# EAGLE design Main+Board (EAGLE 9.7.0)
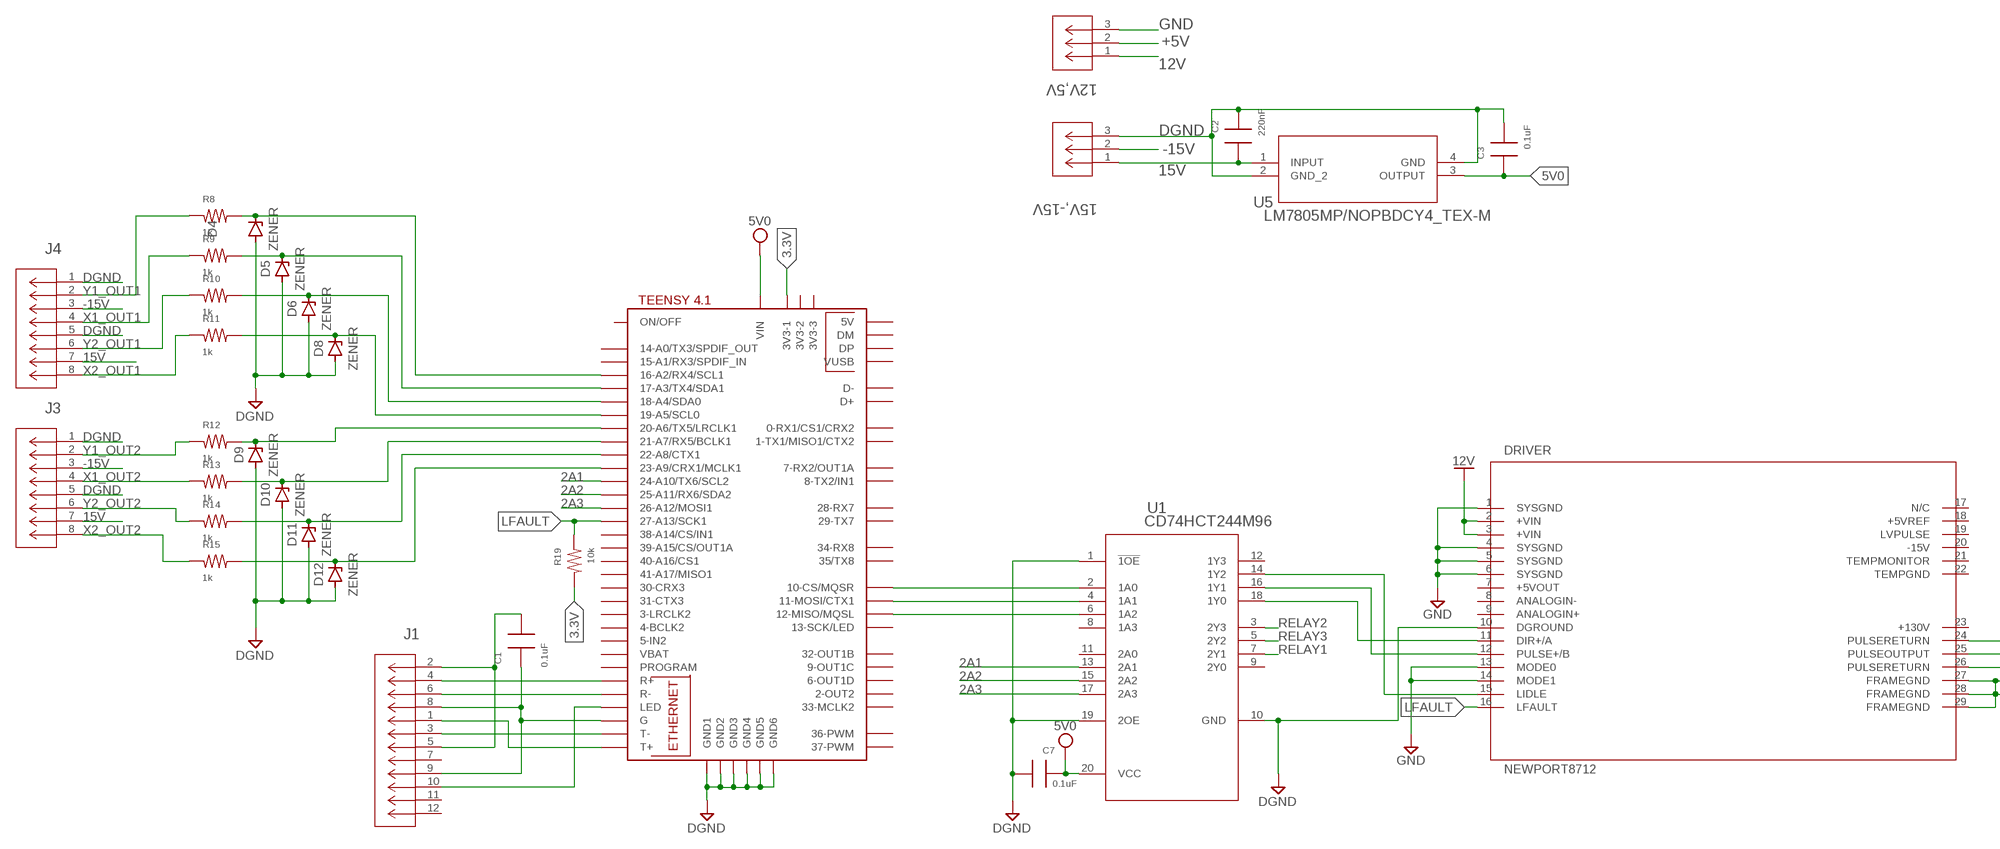
[diagram p0: schematic, sheet 1, part 1 of 2]
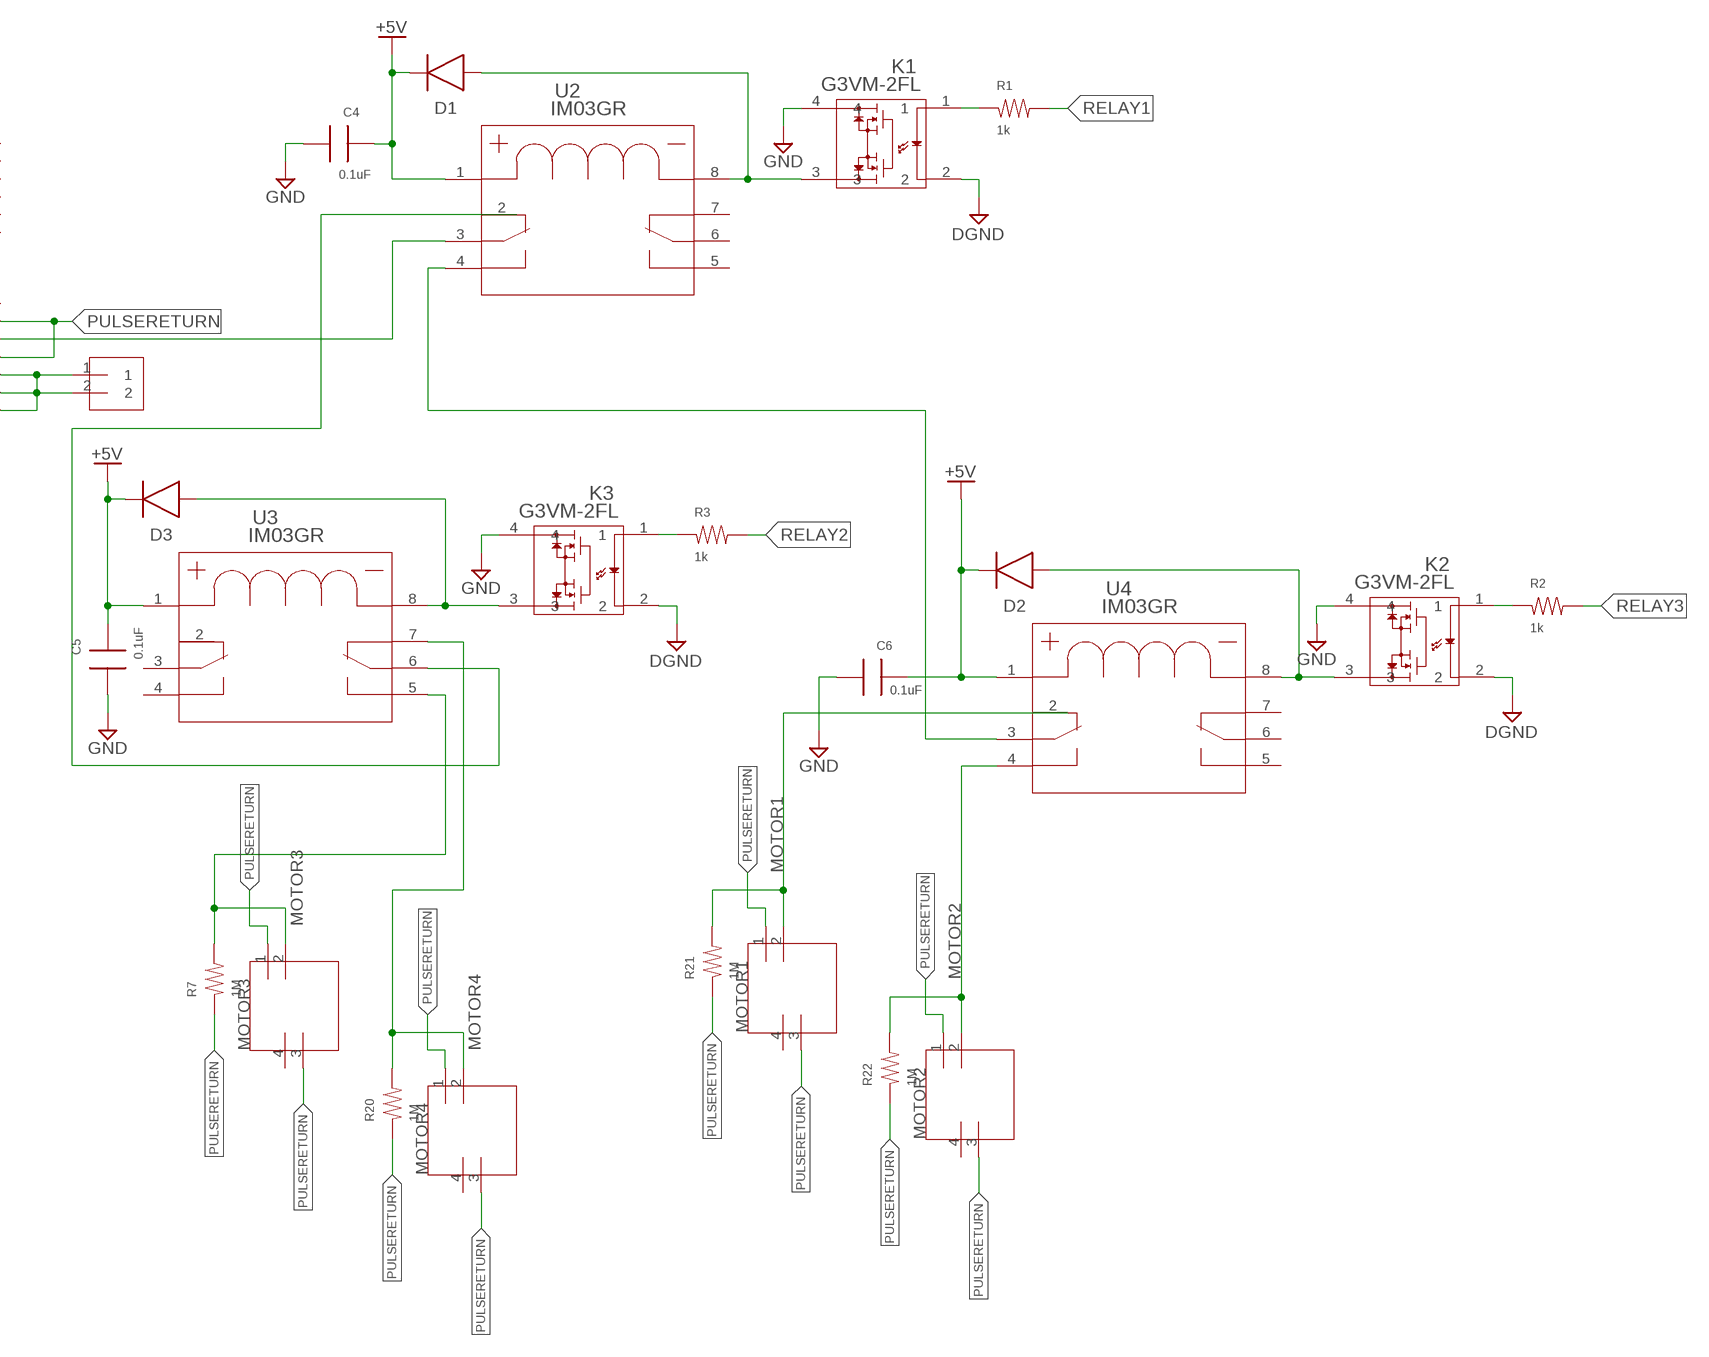
[diagram p1: schematic, sheet 1, part 2 of 2]

## Parts
12V,5V  1729021  [CONN_1729021_PXC]
15V,-15V  1729021  [CONN_1729021_PXC]
C1  0.1uF  CAP0603  [0603]
C2  220nF  CAP0603  [0603]
C3  0.1uF  CAP0603  [0603]
C4  0.1uF  CAP0603  [0603]
C5  0.1uF  CAP0603  [0603]
C6  0.1uF  CAP0603  [0603]
C7  0.1uF  CAP0603  [0603]
D1  1N4448W  DIODE_1N4448W-TP_SOD123G  [SOD3715X135]
D2  1N4448W  DIODE_1N4448W-TP_SOD123G  [SOD3715X135]
D3  1N4448W  DIODE_1N4448W-TP_SOD123G  [SOD3715X135]
D4  ZENER  ZENER_DO-219-AB(SOD123F)  [SODFL3718X115]
D5  ZENER  ZENER_DO-219-AB(SOD123F)  [SODFL3718X115]
D6  ZENER  ZENER_DO-219-AB(SOD123F)  [SODFL3718X115]
D8  ZENER  ZENER_DO-219-AB(SOD123F)  [SODFL3718X115]
D9  ZENER  ZENER_DO-219-AB(SOD123F)  [SODFL3718X115]
D10  ZENER  ZENER_DO-219-AB(SOD123F)  [SODFL3718X115]
D11  ZENER  ZENER_DO-219-AB(SOD123F)  [SODFL3718X115]
D12  ZENER  ZENER_DO-219-AB(SOD123F)  [SODFL3718X115]
DRIVER  NEWPORT8712  [NEWPORT8712]
J1  J1B1211CCD  [CONN12_J1B1211CCD_WIZ]
J3  75869-332LF  [CONN_332LF_AMP]
J4  75869-332LF  [CONN_332LF_AMP]
K1  G3VM-2FL  [A-DIP4_THD_OMR]
K2  G3VM-2FL  [A-DIP4_THD_OMR]
K3  G3VM-2FL  [A-DIP4_THD_OMR]
MOTOR1  TM5RJ3-44  [TM5RJ3-44]
MOTOR2  TM5RJ3-44  [TM5RJ3-44]
MOTOR3  TM5RJ3-44  [TM5RJ3-44]
MOTOR4  TM5RJ3-44  [TM5RJ3-44]
R1  1k  RES0603  [0603]
R2  1k  RES0603  [0603]
R3  1k  RES0603  [0603]
R7  1M  RES1210  [1210]
R8  1k  RES0603  [0603]
R9  1k  RES0603  [0603]
R10  1k  RES0603  [0603]
R11  1k  RES0603  [0603]
R12  1k  RES0603  [0603]
R13  1k  RES0603  [0603]
R14  1k  RES0603  [0603]
R15  1k  RES0603  [0603]
R19  10k  RES0603  [0603]
R20  1M  RES1210  [1210]
R21  1M  RES1210  [1210]
R22  1M  RES1210  [1210]
U1  CD74HCT244M96  [DW20]
U2  IM03GR  [RELAY8-239X396_230]
U3  IM03GR  [RELAY8-239X396_230]
U4  IM03GR  [RELAY8-239X396_230]
U5  LM7805MP/NOPBDCY4_TEX-M  [DCY4_TEX-M]
U$1  TEENSY41  [TEENSY41]
U$2  360272  [360272]

## Nets
2A1: U1.13(2A1) U$1.24-A10/TX6/SCL2
2A2: U1.15(2A2) U$1.25-A11/RX6/SDA2
2A3: U1.17(2A3) U$1.26-A12/MOSI1
3.3V: R19.2 U$1.3V3-1
5V0: C3.1 C7.2 U1.20(VCC) U5.3(OUTPUT) U$1.VIN
12V: 12V,5V.1 DRIVER.2(+VIN) DRIVER.3(+VIN)
15V: 15V,-15V.1 C2.1 J3.7 J4.7 U5.1(INPUT)
+5V: 12V,5V.2 C4.2 C5.2 C6.2 D1.1(C) D2.1(C) D3.1(C) U2.1 U3.1 U4.1
-15V: 15V,-15V.2 J3.3 J4.3
DGND: 15V,-15V.3 C2.2 C3.2 C7.1 D4.2(A) D5.2(A) D6.2(A) D8.2(A) D9.2(A) D10.2(A) D11.2(A) D12.2(A) DRIVER.10(DGROUND) J3.1 J3.5 J4.1 J4.5 K1.2 K2.2 K3.2 U1.1(!1OE) U1.10(GND) U1.19(2OE) U5.2(GND_2) U5.4(GND) U$1.GND1 U$1.GND2 U$1.GND3 U$1.GND4 U$1.GND5 U$1.GND6
FRAMEGND: DRIVER.27(FRAMEGND) DRIVER.28(FRAMEGND) DRIVER.29(FRAMEGND) U$2.1 U$2.2
GND: 12V,5V.3 C4.1 C5.1 C6.1 DRIVER.1(SYSGND) DRIVER.4(SYSGND) DRIVER.5(SYSGND) DRIVER.6(SYSGND) DRIVER.13(MODE0) DRIVER.14(MODE1) K1.4 K2.4 K3.4
LFAULT: DRIVER.16(LFAULT) R19.1 U$1.27-A13/SCK1
MOTOR1: MOTOR1.2 R21.2 U4.2
MOTOR2: MOTOR2.2 R22.2 U4.4
MOTOR3: MOTOR3.2 R7.2 U3.5
MOTOR4: MOTOR4.2 R20.2 U3.7
N$1: D10.1(C) R13.2 U$1.21-A7/RX5/BCLK1
N$3: K1.1 R1.1
N$5: D4.1(C) R8.2 U$1.16-A2/RX4/SCL1
N$6: D5.1(C) R9.2 U$1.17-A3/TX4/SDA1
N$7: D6.1(C) R10.2 U$1.18-A4/SDA0
N$8: D8.1(C) R11.2 U$1.19-A5/SCL0
N$9: U1.2(1A0) U$1.10-CS\MQSR(10-CS/MQSR)
N$10: U1.4(1A1) U$1.11-MOSI/CTX1
N$11: U1.6(1A2) U$1.12-MISO/MQSL
N$12: K2.1 R2.1
N$13: K3.1 R3.1
N$17: C1.2 J1.2 J1.5
N$22: DRIVER.15(LIDLE) U1.14(1Y2)
N$23: DRIVER.12(PULSE+/B) U1.16(1Y1)
N$24: DRIVER.11(DIR+/A) U1.18(1Y0)
N$29: D3.2(A) K3.3 U3.8
N$31: D9.1(C) R12.2 U$1.20-A6/TX5/LRCLK1
N$32: U2.2 U3.6
N$34: U2.4 U4.3
N$35: D1.2(A) K1.3 U2.8
N$36: D2.2(A) K2.3 U4.8
N$38: D12.1(C) R15.2 U$1.23-A9/CRX1/MCLK1
N$43: D11.1(C) R14.2 U$1.22-A8/CTX1
N$50: C1.1 J1.8 J1.9 U$1.G
N$51: J1.10 U$1.LED
PULSEOUTPUT: DRIVER.25(PULSEOUTPUT) U2.3
PULSERETURN: DRIVER.24(PULSERETURN) DRIVER.26(PULSERETURN) MOTOR1.1 MOTOR1.3 MOTOR2.1 MOTOR2.3 MOTOR3.1 MOTOR3.3 MOTOR4.1 MOTOR4.3 R7.1 R20.1 R21.1 R22.1
R_N: J1.6 U$1.R-
R_P: J1.4 U$1.R+
RELAY1: R1.2 U1.7(2Y1)
RELAY2: R3.2 U1.3(2Y3)
RELAY3: R2.2 U1.5(2Y2)
T_N: J1.3 U$1.T-
T_P: J1.1 U$1.T+
X1_OUT1: J4.4 R9.1
X1_OUT2: J3.4 R13.1
X2_OUT1: J4.8 R11.1
X2_OUT2: J3.8 R15.1
Y1_OUT1: J4.2 R8.1
Y1_OUT2: J3.2 R12.1
Y2_OUT1: J4.6 R10.1
Y2_OUT2: J3.6 R14.1
Unconnected: DRIVER.7(+5VOUT) DRIVER.8(ANALOGIN-) DRIVER.9(ANALOGIN+) DRIVER.17(N/C) DRIVER.18(+5VREF) DRIVER.19(LVPULSE) DRIVER.20(-15V) DRIVER.21(TEMPMONITOR) DRIVER.22(TEMPGND) DRIVER.23(+130V) J1.7 J1.11 J1.12 MOTOR1.4 MOTOR2.4 MOTOR3.4 MOTOR4.4 U1.8(1A3) U1.9(2Y0) U1.11(2A0) U1.12(1Y3) U2.5 U2.6 U2.7 U3.2 U3.3 U3.4 U4.5 U4.6 U4.7 U$1.0-RX1/CS1/CRX2 U$1.1-TX1/MISO1/CTX2 U$1.2-OUT2 U$1.3-LRCLK2 U$1.3V3-2 U$1.3V3-3 U$1.4-BCLK2 U$1.5-IN2 U$1.6-OUT1D U$1.7-RX2/OUT1A U$1.8-TX2/IN1 U$1.9-OUT1C U$1.13-SCK/LED U$1.14-A0/TX3/SPDIF_OUT U$1.15-A1/RX3/SPDIF_IN U$1.28-RX7 U$1.29-TX7 U$1.30-CRX3 U$1.31-CTX3 U$1.32-OUT1B U$1.33-MCLK2 U$1.34-RX8 U$1.35-TX8(35/TX8) U$1.36-PWM U$1.37-PWM U$1.38-A14/CS/IN1 U$1.39-A15/CS/OUT1A U$1.40-A16/CS1 U$1.41-A17/MISO1 U$1.+5V(5V) U$1.D+ U$1.D- U$1.DM U$1.DP U$1.ON/OFF U$1.PROGRAM U$1.VBAT U$1.VUSB

## Library data of the parts
12V,5V 15V,-15V = 1729021:1729021; BUILT_BY: EMA_Cory; COPYRIGHT: Copyright (C) 2018 Accelerated Designs. All rights reserved; DATASHEET: https://www.phoenixcontact.com/online/portal/us/?uri=pxc-oc-itemdetail:pid=1729021&library=usen&pcck=P-11-01-05&tab=1&selectedCategory=ALL; DIGIKEY: 277-1237-ND; MANUFACTURER_PART_NUMBER: 1729021; SOURCELIBRARY: Phoenix_Contact_2020-02-20; VENDOR: Phoenix Contact
C1 C3-C7 = rlc-jqi:CAP: SMT Capacitor; DIGIKEY: 478-7018-1-ND
C2 = rlc-jqi:CAP: SMT Capacitor; DIGIKEY: 732-7991-1-ND
D1-D3 = Diode:DIODE_: Diode Rectifier - Popular parts; CATEGORY: Diode; DESCRIPTION: DIODE GEN PURP 75V 250MA SOD123; DIGIKEY: 2721-1N4148WTR-ND; MANUFACTURER: Micro Commercial Co; SUB-CATEGORY: Rectifier
D4-D6 D8-D12 = Diode:ZENER: Zener Diode - Generic; CATEGORY: Diode; DIGIKEY: 846-KDZVTR3.3BCT-ND; SUB-CATEGORY: Zener
DRIVER = Newport 8712:NEWPORT8712
J1 = J1B1211CCD:J1B1211CCD; BUILT_BY: EMA_Matt; COPYRIGHT: Copyright (C) 2018 Accelerated Designs. All rights reserved; DATASHEET: http://wizwiki.net/wiki/lib/exe/fetch.php?media=products:wiz550web:wiz550webds_kr:j1b1211ccd.pdf; DIGIKEY: 1278-1052-ND; MANUFACTURER_PART_NUMBER: J1B1211CCD; SOURCELIBRARY: WIZnet_2020-06-05; VENDOR: WIZnet
J3 J4 = 75869-332LF:75869-332LF; BUILT_BY: EMA_Matt; COPYRIGHT: Copyright (C) 2018 Accelerated Designs. All rights reserved; DIGIKEY: 609-5123-ND; MANUFACTURER_PART_NUMBER: 75869-332LF; SOURCELIBRARY: Amphenol_2019-10-30; VENDOR: Amphenol
K1-K3 = G3VM-2FL:G3VM-2FL; BUILT_BY: EMA_Justin; COPYRIGHT: Copyright (C) 2018 Accelerated Designs. All rights reserved; DIGIKEY: Z2711-ND; MANUFACTURER_PART_NUMBER: G3VM-2FL; SOURCELIBRARY: Omron_2020-03-23; VENDOR: Omron
MOTOR1-MOTOR4 = TM5RJ3-44:TM5RJ3-44; DIGIKEY: H11287-ND
R1-R3 R8-R15 = rlc-jqi:RES: SMT Resistor; DIGIKEY: P123733CT-ND
R7 R20-R22 = rlc-jqi:RES: SMT Resistor; DIGIKEY: 13-RC1210FR-071MLCT-ND
R19 = rlc-jqi:RES: SMT Resistor; DIGIKEY: YAG1236CT-ND
U1 = CD74HCT244:CD74HCT244M96; DATASHEET_URL: http://www.ti.com/lit/gpn/CD74HCT244; DESCRIPTION: High Speed CMOS Logic Non-Inverting Octal Buffer/Line Drivers with 3-State Outputs; DIGIKEY: 296-14552-1-ND; FAMILY_NAME: NON-INVERTING BUFFER/DRIVER; GENERIC_PART_NUMBER: CD74HCT244; INDUSTRY_STD_PKG_TYPE: SOIC; MANUFACTURER: Texas Instruments; PACKAGE_DESIGNATOR: DW; PIN_COUNT: 20
U2-U4 = IM03GR:IM03GR; BUILT_BY: EMA_UL_Team; COPYRIGHT: Copyright (C) 2016 Accelerated Designs. All rights reserved; DIGIKEY: PB1061CT-ND; MANUFACTURER_PART_NUMBER: IM03GR; SOURCELIBRARY: Tyco_2012-1-03; VENDOR: TE Connectivity
U5 = LM7805MP:LM7805MP/NOPB; BUILT_BY: EMA_Jessica; COPYRIGHT: Copyright (C) 2018 Accelerated Designs. All rights reserved; DIGIKEY: 296-44517-1-ND; MANUFACTURER_PART_NUMBER: LM7805MP/NOPB; SOURCELIBRARY: TI_2019-05-10; VENDOR: Texas Instruments
U$1 = teensy:TEENSY41; DIGIKEY: 1568-DEV-16771-ND
U$2 = 360272:360272; DIGIKEY: 1849-1246-ND

## Board
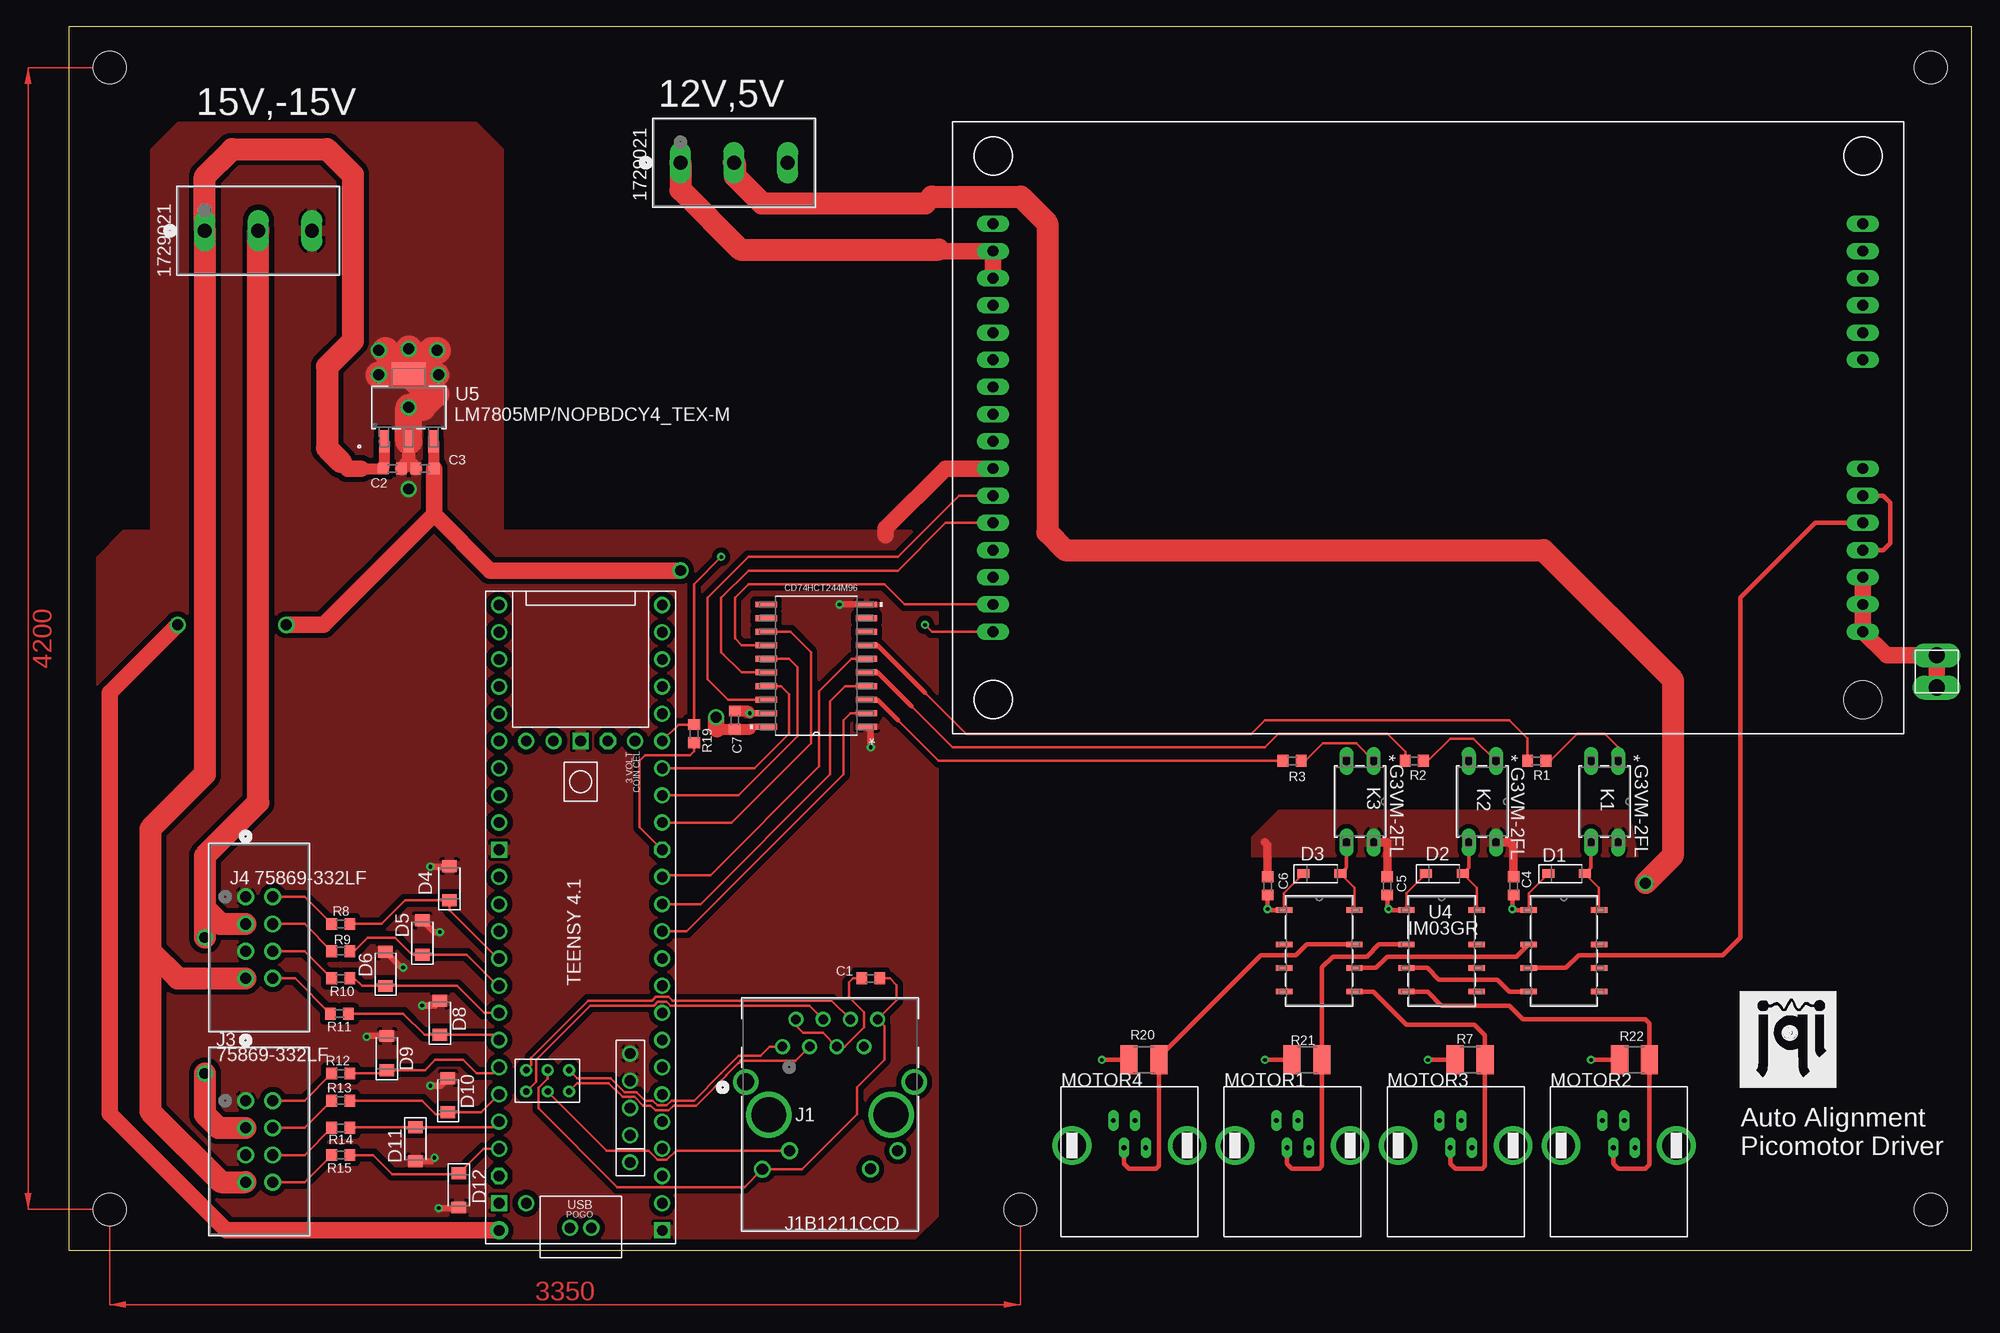
[diagram p2: board, top side]
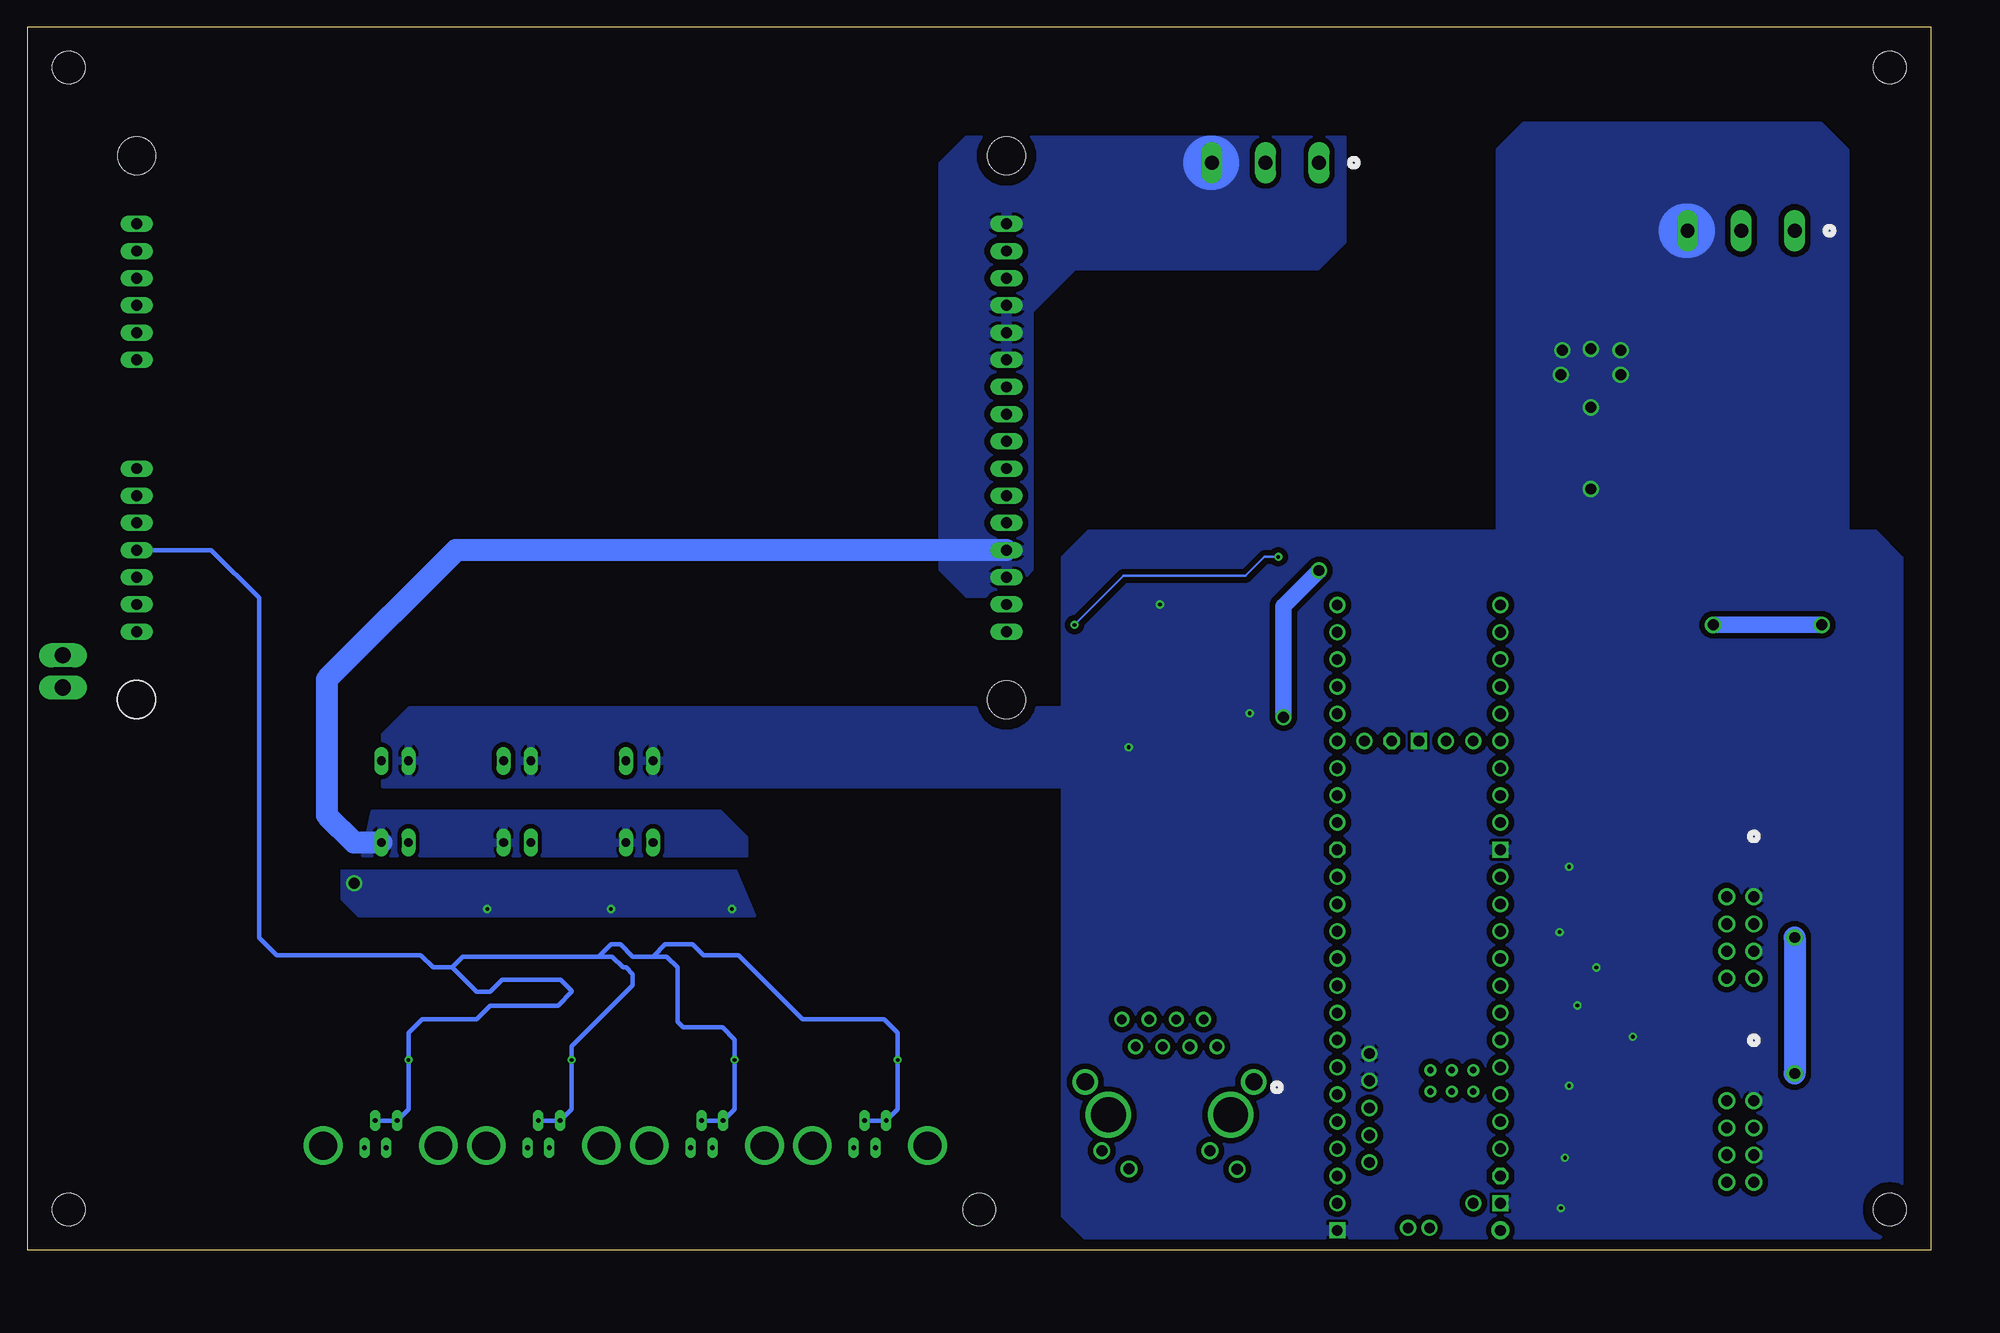
[diagram p3: board, bottom side, seen from below]

Size 177.8 x 114.3 mm. Coordinates in mm from the lower left corner, seen from the top.
Outline: 0,0 177.8,0 177.8,114.3 0,114.3 0,0
Copper layers (1*16): Top / Bottom
Stack-up Default Layer Stack: Top User Defined 0.035mm / Dielectric-1 User Defined 1.5mm / Bottom User Defined 0.035mm
Design rules: minimum copper width 6mil, minimum drill size 0.35mm, copper clearance wire_polygon to wire_polygon 8mil, copper clearance wire_polygon to via 8mil, copper clearance pad_smd to pad_smd 8mil, copper clearance pad_smd to via 8mil, copper clearance via to via 8mil, copper clearance wire_polygon to pad_smd 6mil, copper clearance smd to pad (same net) 6mil, copper clearance smd to via (same net) 6mil, copper clearance smd to smd (same net) 6mil, dimension clearance 40mil, via restrict clearance 0mil, restrict clearance 0mil, drill distance 6mil, keepout clearance 0mil
Holes 3.05 mm at 88.9,3.81 173.99,3.81 3.81,3.81 3.81,110.49 173.99,110.49
Holes 3.56 mm at 86.36,51.44 86.36,102.23 167.64,102.23 167.64,51.44

### Footprints (pad centres in the part's own frame; a part is rotated, then mirrored left to right if it is on the bottom)
CONN_1729021_PXC = drill 1.295 pad 1.803 long: 1 0,0; 2 5.004,0; 3 10.008,0
0603 = smd 1 x 1.1: 1 -0.85,0; 2 0.85,0
SOD3715X135 = smd 1.127 x 0.784: 1 -1.722,0; 2 1.722,0
SODFL3718X115 = smd 1.115 x 1.361: 1 -1.6,0; 2 1.6,0
NEWPORT8712 = drill 1.016 long: 1 3.81,47.625; 2 3.81,45.085; 3 3.81,42.545; 4 3.81,40.005; 5 3.81,37.465; 6 3.81,34.925; 7 3.81,32.385; 8 3.81,29.845; 9 3.81,27.305; 10 3.81,24.765; 11 3.81,22.225; 12 3.81,19.685; 13 3.81,17.145; 14 3.81,14.605; 15 3.81,12.065; 16 3.81,9.525; 17 85.09,47.625; 18 85.09,45.085; 19 85.09,42.545; 20 85.09,40.005; 21 85.09,37.465; 22 85.09,34.925; 23 85.09,24.765; 24 85.09,22.225; 25 85.09,19.685; 26 85.09,17.145; 27 85.09,14.605; 28 85.09,12.065; 29 85.09,9.525
CONN12_J1B1211CCD_WIZ = drill 0.889 pad 1.397: 1 -0.635,3.785; 2 0.635,6.325; 3 1.905,3.785; 4 3.175,6.325; 5 4.445,3.785; 6 5.715,6.325; 7 6.985,3.785; 8 8.255,6.325 | drill 1.041 pad 1.549: 9 -2.515,-7.671; 10 0.025,-5.944; 11 7.595,-7.645; 12 10.135,-5.944 | drill 1.6 pad 2.108: 13 -4.064,0.483; 16 11.684,0.483 | drill 3.251 pad 3.759: 14 -1.905,-2.591; 15 9.525,-2.591
CONN_332LF_AMP = drill 1.041: 1 0,0; 2 0,2.54; 3 2.54,0; 4 2.54,2.54; 5 5.08,0; 6 5.08,2.54; 7 7.62,0; 8 7.62,2.54
A-DIP4_THD_OMR = drill 0.813 pad 1.321 long: 1 0,0; 2 0,-2.54; 3 7.62,-2.54; 4 7.62,0
TM5RJ3-44 = drill 0.45 long: 1 4.88,10.84; 2 5.89,8.3; 3 6.91,10.84; 4 7.92,8.3 | drill 2.6 pad 2.8: P$1 1.02,8.5; P$2 11.78,8.5
1210 = smd 1.6 x 2.7: 1 -1.4,0; 2 1.4,0
DW20 = smd 1.981 x 0.559: 1 -4.686,5.715; 2 -4.686,4.445; 3 -4.686,3.175; 4 -4.686,1.905; 5 -4.686,0.635; 6 -4.686,-0.635; 7 -4.686,-1.905; 8 -4.686,-3.175; 9 -4.686,-4.445; 10 -4.686,-5.715; 11 4.686,-5.715; 12 4.686,-4.445; 13 4.686,-3.175; 14 4.686,-1.905; 15 4.686,-0.635; 16 4.686,0.635; 17 4.686,1.905; 18 4.686,3.175; 19 4.686,4.445; 20 4.686,5.715
RELAY8-239X396_230 = smd 1.524 x 0.508: 1 -3.289,3.835; 2 -3.289,0.635; 3 -3.289,-1.575; 4 -3.289,-3.785; 5 3.289,-3.785; 6 3.289,-1.575; 7 3.289,0.635; 8 3.289,3.835
DCY4_TEX-M = smd 0.94 x 2.07: 1 -2.311,-3.169; 2 0,-3.169; 3 2.311,-3.169 | smd 3.2 x 2.07: 4 0,3.169
TEENSY41 = drill 1: 0-RX1/CS1/CRX2 -27.94,-7.62; 1-TX1/MISO1/CTX2 -25.4,-7.62; 2-OUT2 -22.86,-7.62; 3-LRCLK2 -20.32,-7.62; 4-BCLK2 -17.78,-7.62; 5-IN2 -15.24,-7.62; 6-OUT1D -12.7,-7.62; 7-RX2/OUT1A -10.16,-7.62; 8-TX2/IN1 -7.62,-7.62; 9-OUT1C -5.08,-7.62; 10-CS\MQSR -2.54,-7.62; 11-MOSI/CTX1 0,-7.62; 12-MISO/MQSL 2.54,-7.62; 13-SCK/LED 2.54,7.62; 14-A0/TX3/SPDIF_OUT 0,7.62; 15-A1/RX3/SPDIF_IN -2.54,7.62; 16-A2/RX4/SCL1 -5.08,7.62; 17-A3/TX4/SDA1 -7.62,7.62; 18-A4/SDA0 -10.16,7.62; 19-A5/SCL0 -12.7,7.62; 20-A6/TX5/LRCLK1 -15.24,7.62; 21-A7/RX5/BCLK1 -17.78,7.62; 22-A8/CTX1 -20.32,7.62; 23-A9/CRX1/MCLK1 -22.86,7.62; 24-A10/TX6/SCL2 7.62,-7.62; 25-A11/RX6/SDA2 10.16,-7.62; 26-A12/MOSI1 12.7,-7.62; 27-A13/SCK1 15.24,-7.62; 28-RX7 17.78,-7.62; 29-TX7 20.32,-7.62; 30-CRX3 22.86,-7.62; 31-CTX3 25.4,-7.62; 32-OUT1B 27.94,-7.62; 33-MCLK2 27.94,7.62; 34-RX8 25.4,7.62; 35-TX8 22.86,7.62; 36-PWM 20.32,7.62; 37-PWM 17.78,7.62; 38-A14/CS/IN1 15.24,7.62; 39-A15/CS/OUT1A 12.7,7.62; 40-A16/CS1 10.16,7.62; 41-A17/MISO1 7.62,7.62; +5V -24.13,-4.62; D+ -30.25,-1; D- -30.25,1; DM -21.59,-4.62; DP -19.05,-4.62; GND4 -16.51,-4.62; GND5 -13.97,-4.62; ON/OFF 15.24,5.08; PROGRAM 15.24,2.54; VBAT 15.24,-5.08; VUSB -27.94,5.08 | drill 1 octagon: 3V3-1 5.08,-7.62; 3V3-2 15.24,-2.54; 3V3-3 -25.4,7.62 | drill 0.6: G -15.51,3.08; LED -17.51,3.08; R+ -17.51,5.08; R- -15.51,5.08; T+ -15.51,1.08; T- -17.51,1.08 | drill 1 square: GND1 -30.48,-7.62; GND2 15.24,0; GND3 5.08,7.62; GND6 -27.94,7.62 | drill 1 pad 1.676: VIN -30.48,7.62
360272 = drill 1.5 long: 1 2,0.5; 2 2,3.5

### Placement (x,y rotation side)
12V,5V  57.15,101.6 0 top
15V,-15V  12.7,95.25 0 top
C1  74.93,25.4 180 top
C2  30.23,73.03 0 top
C3  33.27,73.03 180 top
C4  135,34.04 270 top
C5  123.19,34.04 270 top
C6  112.01,34.04 270 top
C7  62.23,49.53 270 top
D1  139.95,35.18 0 top
D2  128.52,35.18 0 top
D3  117.09,35.18 0 top
D4  35.56,34.29 90 top
D5  33.02,29.21 90 top
D6  29.59,26.29 90 top
D8  34.67,21.72 90 top
D9  29.73,18.41 90 top
D10  35.43,14.48 90 top
D11  32.38,9.91 270 top
D12  36.45,5.59 270 top
DRIVER  82.55,48.26 0 top
J1  67.31,15.24 0 top
J3  16.51,13.97 270 top
J4  16.51,33.02 270 top
K1  144.78,45.72 270 top
K2  133.35,45.72 270 top
K3  121.92,45.72 270 top
LOGO1  JQI-LOGOSILK  [JQI_LOGO_NEGATIVE-SILKSCREEN@1]  156.21,15.24 0 top
MOTOR1  107.95,1.27 0 top
MOTOR2  138.43,1.27 0 top
MOTOR3  123.19,1.27 0 top
MOTOR4  92.71,1.27 0 top
R1  137.16,45.72 180 top
R2  125.73,45.72 180 top
R3  114.3,45.72 180 top
R7  130.94,17.78 0 top
R8  25.4,30.48 0 top
R9  25.4,27.94 0 top
R10  25.4,25.4 0 top
R11  25.27,22.1 0 top
R12  25.4,16.51 0 top
R13  25.4,13.97 0 top
R14  25.4,11.43 0 top
R15  25.4,8.89 0 top
R19  58.42,48.26 270 top
R20  100.46,17.78 0 top
R21  115.7,17.78 0 top
R22  146.3,17.78 0 top
U1  69.85,54.61 180 top
U2  139.7,27.94 0 top
U3  116.84,27.94 0 top
U4  128.27,27.94 0 top
U5  31.75,78.74 0 top
U$1  47.82,32.33 90 top
U$2  172.53,52.07 0 top
U$3  AUTOALIGNMENT  [AUTOALIGNMENT]  156.21,8.89 0 top

### Tracks (layer width: path | path; a pad name or v marks a point on that pad's centre or on a via)
2A1
  Top 0.254: U$1.24-A10/TX6/SCL2 61.92,39.95 69.34,47.37 69.34,55.88 67.44,57.78 U1.13
2A2
  Top 0.254: U$1.25-A11/RX6/SDA2 62.56,42.49 68.07,48.01 68.07,54.48 67.31,55.24 U1.15
2A3
  Top 0.254: U$1.26-A12/MOSI1 64.08,45.03 67.31,48.26 67.31,51.94 66.55,52.7 U1.17
3.3V
  Top 0.254: U$1.3V3-1 53.34,39.52 53.34,45.72 53.85,46.23 58.04,46.23 58.42,46.61 R19.2
5V0  (via drill 1.02)
  Top 0.61: 63.67,48.68 63.88,48.9 U1.20
  Top 1.016: U5.3 34.06,73.09 C3.1 | 60.55,48.68 C7.2 63.67,48.68
  Top 1.524: C3.1 34.12,68.75 | 34.12,68.75 39.37,63.5 v57.15,63.5 | 34.12,68.75 23.8,58.42 v20.32,58.42 | v10.16,58.42 3.81,52.07 3.81,12.75 14.71,1.85 U$1.VIN | v60.47,49.8 | v60.47,49.8 60.47,48.77 60.55,48.68
  Bottom 1.524: v20.32,58.42 v10.16,58.42 | v57.15,63.5 60.47,60.18 v60.47,49.8
12V
  Top 1.524: 81.28,93.47 81.41,93.34 DRIVER.2 DRIVER.3
  Top 2.032: 12V,5V.1 57.15,99.06 62.74,93.47 81.28,93.47
15V
  Top 1.016: U5.1 29.44,73.09 C2.1 27.3,73.03
  Top 1.524: 25.4,73.66 26.04,73.03 27.3,73.03
  Top 2.032: 25.4,73.66 24.13,74.93 24.13,82.55 26.52,84.94 26.52,100.48 24.13,102.87 15.24,102.87 12.7,100.33 15V,-15V.1 12.7,44.45 7.62,39.37 7.62,27.94 | 7.62,27.94 10.16,25.4 J4.7 | 7.62,27.94 7.62,12.94 14.21,6.35 J3.7
+5V  (via drill 0.35, 1.02)
  Top 0.254: U2.1 136.41,33.36 D1.1 | U4.1 124.98,33.36 D2.1 | D3.1 113.55,33.36 U3.1
  Top 0.406: U2.1 134.98,31.77 v134.87,31.88 134.87,33.06 C4.2 | U4.1 123.42,31.77 v123.32,31.88 123.19,32 C5.2 | U3.1 112.12,31.77 v112.01,31.88 C6.2
  Top 2.032: 12V,5V.2 62.23,101.52 62.23,100.33 64.77,97.79 80.01,97.79 80.64,98.42 88.95,98.42 91.44,95.94 91.44,67.06 93.09,65.41 137.79,65.41 149.86,53.34 149.86,36.83 v147.32,34.29
  pour Bottom (isolate 0.406): 148.59,35.56 111.54,35.56 109.75,31.22 109.86,31.11 146.94,31.11 148.59,32.77
-15V  (via drill 1.02)
  Top 2.032: 15V,-15V.2 17.7,41.83 12.7,36.83 12.7,31.94 | J4.3 14.16,30.48 12.7,31.94 | 12.7,31.94 v12.7,29.21 | v12.7,16.51 12.7,12.7 13.97,11.43 J3.3
  Bottom 2.032: v12.7,29.21 v12.7,16.51
DGND  (via drill 0.35, 0.36, 1.02)
  Top 0.61: v34.54,3.94 36.4,3.94 D12.2 | v34.16,8.64 33.83,8.31 D11.2 | v33.78,15.37 34.72,15.37 D10.2 | v27.81,19.94 27.89,20.02 D9.2 | v33.02,22.86 34.21,22.86 D8.2 | v31.24,26.42 31.06,26.42 D6.2 | v34.67,29.72 34.11,29.72 D5.2 | v33.78,35.81 35.48,35.81 D4.2 | v63.63,50.16 U1.19 | U1.1 74.93,48.5 v74.93,46.99 | U1.10 v72.01,60.33
  Top 1.016: C7.1 63.41,50.38 v63.63,50.16
  Top 1.27: 31.75,73.7 C2.2 | U5.2 31.75,73.7 | 31.75,73.7 C3.2
  Top 1.524: DRIVER.10 81.92,73.03 76.33,67.44 76.33,66.8
  Top 2.032: U5.4 34.42,81.91 v34.54,81.79
  Top 2.54: U5.4 v31.75,84.2 | U5.4 33.91,84.07 v34.42,84.07 | U5.4 29.59,84.07 | U5.4 31.63,81.79 v28.96,81.79 | U5.4 33.65,80.01 34.29,80.01 33.02,78.74 v31.75,78.74 U5.2
  Bottom 5.08: 15V,-15V.3 22.86,95.25
  other vias: 31.75,71.12 28.96,84.07
  pour Bottom (isolate 0.508): 78.74,0.64 5.08,0.64 2.54,3.17 2.54,64.77 5.08,67.31 78.74,67.31 81.28,64.77 81.28,3.17
  pour Top (isolate 0.508): 78.74,0.64 5.08,0.64 2.54,3.17 2.54,64.77 5.08,67.31 78.74,67.31 81.28,64.77 81.28,3.17
  pour Bottom (isolate 0.406): 144.78,43.18 80.01,43.18 80.01,50.8 142.24,50.8 144.78,48.26
  pour Top (isolate 0.508): 7.62,66.04 7.62,102.87 10.16,105.41 38.1,105.41 40.64,102.87 40.64,66.04
  pour Bottom (isolate 0.508): 7.62,66.04 7.62,102.87 10.16,105.41 38.1,105.41 40.64,102.87 40.64,66.04
FRAMEGND
  Top 1.524: DRIVER.27 DRIVER.28 DRIVER.29 169.85,55.57 U$2.2 U$2.1
GND
  Top 0.813: C5.1 123.19,38.1 K3.4 | C6.1 112.01,37.85 111.76,38.1 | C4.1 135,37.72 134.62,38.1 K2.4
  Bottom 2.032: DRIVER.13 137.79,65.41 149.86,53.34 149.86,40.64 147.32,38.1 K1.4
  Bottom 5.08: 12V,5V.3 67.31,101.6
  pour Bottom (isolate 0.508, rank 2): 54.61,104.14 90.17,104.14 92.71,101.6 92.71,63.5 90.17,60.96 86.36,60.96 83.82,63.5 83.82,87.63 79.88,91.57 57.15,91.57 54.61,94.11
  pour Bottom (isolate 0.406): 110.49,36.7 110.49,38.61 113.03,41.15 145.73,41.15 146.69,36.7
  pour Top (isolate 0.406): 110.49,36.7 110.49,38.61 113.03,41.15 145.75,41.15 146.7,36.7
LFAULT  (via drill 0.35)
  Top 0.254: DRIVER.16 80.64,57.78 v80.01,58.42 | v60.96,64.77 58.42,62.23 R19.1 56.98,49.11 U$1.27-A13/SCK1
  Bottom 0.254: v80.01,58.42 75.44,62.99 64.01,62.99 62.23,64.77 v60.96,64.77
MOTOR1
  Top 0.406: U4.2 122.43,28.57 121.28,27.43 118.11,27.43 117.1,26.42 R21.2 117.1,7.88 116.84,7.62 114.3,7.62 113.84,8.08 MOTOR1.2
MOTOR2
  Top 0.406: MOTOR2.2 144.32,8.08 144.78,7.62 147.32,7.62 147.7,8 R22.2 147.7,21.21 147.32,21.59 135.89,21.59 134.62,22.86 128.27,22.86 126.97,24.16 U4.4
MOTOR3
  Top 0.406: MOTOR3.2 129.08,8.08 129.54,7.62 132.08,7.62 132.34,7.88 R7.2 132.34,20.06 131.32,21.08 124.97,21.08 121.89,24.16 U3.5
MOTOR4
  Top 0.406: U3.7 115.7,28.57 114.68,27.56 111.38,27.56 101.86,18.04 R20.2 101.86,7.88 101.6,7.62 99.06,7.62 98.6,8.08 MOTOR4.2
N$1
  Top 0.254: R13.2 33.02,13.97 34.29,12.7 35.26,12.7 D10.1 38.52,12.88 U$1.21-A7/RX5/BCLK1
N$3
  Top 0.254: K1.1 144.78,46.99 143.51,48.26 140.97,48.26 138.43,45.72 R1.1
N$5
  Top 0.254: R8.2 29.21,30.48 31.42,32.69 D4.1 35.56,31.75 40.06,27.25 U$1.16-A2/RX4/SCL1
N$6
  Top 0.254: R9.2 26.67,27.94 27.94,29.21 30.48,29.21 32.08,27.61 D5.1 37.16,27.61 40.06,24.71 U$1.17-A3/TX4/SDA1
N$7
  Top 0.254: R10.2 26.67,25.4 27.38,24.69 D6.1 36.27,24.69 38.79,22.17 U$1.18-A4/SDA0
N$8
  Top 0.254: R11.2 31.24,22.1 33.22,20.12 D8.1 39.72,20.12 U$1.19-A5/SCL0
N$9
  Top 0.254: U1.2 73.03,50.16 72.39,49.53 72.39,44.45 57.73,29.79 U$1.10-CS\MQSR
N$10
  Top 0.254: U1.4 72.52,52.7 71.12,51.31 71.12,44.45 59,32.33 U$1.11-MOSI/CTX1
N$11
  Top 0.254: U1.6 73.15,55.24 70.1,52.2 70.1,45.21 59.94,35.05 55.62,35.05 U$1.12-MISO/MQSL
N$12
  Top 0.254: R2.1 127,45.72 129.08,47.8 131.27,47.8 K2.1
N$13
  Top 0.254: R3.1 115.57,45.72 117.2,47.35 120.29,47.35 K3.1
N$17
  Top 0.254: J1.2 67.94,20.95 68.58,20.32 70.46,20.32 J1.5 72.49,19.02 74.3,20.83 74.3,22.23 72.9,23.62 72.9,25.02 73.28,25.4 C1.2
N$22
  Top 0.254: U1.14 62.87,56.52 62.23,57.15 62.23,60.96 63.5,62.23 76.2,62.23 78.11,60.33 DRIVER.15
N$23
  Top 0.254: U1.16 62.87,53.98 60.96,55.88 60.96,60.96 63.5,63.5 77.47,63.5 81.92,67.94 DRIVER.12
N$24
  Top 0.254: U1.18 61.59,51.44 59.69,53.34 59.69,60.96 63.5,64.77 77.47,64.77 83.19,70.48 DRIVER.11
N$29
  Top 0.254: U3.8 120.13,33.87 D3.2
  Top 0.305: K3.3 119.38,35.74 D3.2
N$31
  Top 0.254: R12.2 29.42,16.51 D9.1 33.27,16.82 34.23,17.78 36.83,17.78 38.1,16.51 39.62,16.51 U$1.20-A6/TX5/LRCLK1
N$32
  Top 0.406: U2.2 135.27,27.43 123.19,27.43 122.12,26.36 U3.6
N$34
  Top 0.406: U2.4 134.59,24.16 133.48,25.27 128.02,25.27 126.92,26.36 U4.3
N$35
  Top 0.254: D1.2 142.99,33.87 U2.8
  Top 0.305: K1.3 142.24,35.74 D1.2
N$36
  Top 0.254: D2.2 131.56,33.87 U4.8
  Top 0.305: K2.3 130.81,35.74 D2.2
N$38
  Top 0.254: R15.2 28.45,8.89 30.23,7.11 36.37,7.11 D12.1 38.73,9.47 U$1.23-A9/CRX1/MCLK1
N$43
  Top 0.254: R14.2 26.33,11.51 D11.1 39.69,11.51 U$1.22-A8/CTX1
N$50
  Top 0.254: U$1.G 44.74,16 43.91,15.17 43.91,13.24 51.25,5.9 63.13,5.9 J1.9 68.53,7.57 73.66,12.7 73.66,15.24 76.2,17.78 76.2,20.93 J1.8 77.34,23.34 77.34,24.77 76.71,25.4 C1.1
N$51
  Top 0.254: U$1.LED 50.27,9.3 54.16,9.3 55.01,8.44 55.87,8.44 56.72,9.3 J1.10
PULSEOUTPUT
  Top 0.406: DRIVER.25 163.19,67.94 156.21,60.96 156.21,29.21 154.56,27.56 141.1,27.56 139.9,26.36 U2.3
PULSERETURN  (via drill 0.35)
  Top 0.406: DRIVER.24 169.54,70.48 170.18,69.85 170.18,66.04 169.54,65.41 DRIVER.26 | v111.76,17.78 R21.1 | v96.52,17.78 R20.1 | v127,17.78 R7.1 | v142.24,17.78 R22.1
  Bottom 0.406: MOTOR1.3 MOTOR1.1 111.76,13.18 v111.76,17.78 111.76,19.68 112.9,20.83 116.59,20.83 117.09,21.34 117.09,26.42 118.11,27.43 119.38,27.43 | MOTOR4.3 MOTOR4.1 96.52,13.18 v96.52,17.78 96.52,20.32 97.79,21.59 105.41,21.59 111.38,27.56 114.68,27.56 115.7,28.57 118.24,28.57 119.38,27.43 | MOTOR3.3 MOTOR3.1 127,13.18 v127,17.78 127,19.05 121.28,24.77 121.28,25.78 121.92,26.42 122.17,26.42 123.19,27.43 124.46,27.43 | MOTOR2.3 MOTOR2.1 142.24,13.18 v142.24,17.78 142.24,20.32 140.97,21.59 135.89,21.59 134.62,22.86 128.27,22.86 127,24.13 127,24.26 128.02,25.27 133.48,25.27 134.62,24.13 135.89,24.13 138.18,26.42 | DRIVER.26 160.66,65.41 156.21,60.96 156.21,29.21 154.56,27.56 141.1,27.56 139.95,26.42 138.18,26.42 | 138.18,26.42 137.16,27.43 124.46,27.43 | 124.46,27.43 123.32,28.57 122.43,28.57 121.28,27.43 119.38,27.43
R_N
  Top 0.254: J1.6 71.27,23.32 56.41,23.32 56.06,23.66 54.82,23.66 54.48,23.32 48.53,23.32 43.18,17.97 43.18,17.26 U$1.R-
R_P
  Top 0.254: J1.4 69.19,22.86 56.22,22.86 55.87,23.21 55.01,23.21 54.66,22.86 48.72,22.86 43.64,17.78 43.64,15.72 U$1.R+
RELAY1
  Top 0.254: 80.01,52.07 83.82,48.26 110.49,48.26 111.76,49.53 134.62,49.53 136.31,47.84 R1.2
  Top 0.406: U1.7 75.56,56.52 80.01,52.07
RELAY2
  Top 0.254: 77.47,49.53 81.28,45.72 R3.2
  Top 0.406: U1.3 75.56,51.44 77.47,49.53
RELAY3
  Top 0.254: 78.74,50.8 82.55,46.99 111.76,46.99 113.03,48.26 123.19,48.26 124.88,46.57 R2.2
  Top 0.406: U1.5 75.56,53.98 78.74,50.8
T_N
  Top 0.254: J1.3 67.89,17.7 62.78,17.7 62.61,17.53 62.55,17.46 61.42,16.33 61.42,16.32 58.61,13.51 56.51,13.51 56.06,13.06 54.82,13.06 54.37,13.51 53.67,13.51 52.87,14.32 51.72,14.32 50.44,15.6 47.51,15.6 U$1.T-
T_P
  Top 0.254: J1.1 65.49,19.02 64.62,18.16 62.6,18.16 60.96,16.52 60.96,16.51 58.42,13.97 56.32,13.97 55.87,13.52 55.01,13.52 54.56,13.97 53.86,13.97 53.06,14.78 51.91,14.78 50.63,16.05 47.51,16.05 U$1.T+
X1_OUT1
  Top 0.254: J4.4 22.01,30.48 R9.1
X1_OUT2
  Top 0.254: J3.4 22.01,11.43 R13.1
X2_OUT1
  Top 0.254: J4.8 21.12,25.4 R11.1
X2_OUT2
  Top 0.254: J3.8 22.01,6.35 R15.1
Y1_OUT1
  Top 0.254: J4.2 22.01,33.02 R8.1
Y1_OUT2
  Top 0.254: J3.2 22.01,13.97 R12.1
Y2_OUT1
  Top 0.254: J4.6 22.01,27.94 R10.1
Y2_OUT2
  Top 0.254: J3.6 22.01,8.89 R14.1
(copper drawn outside any net)
  shapes: Top area x2